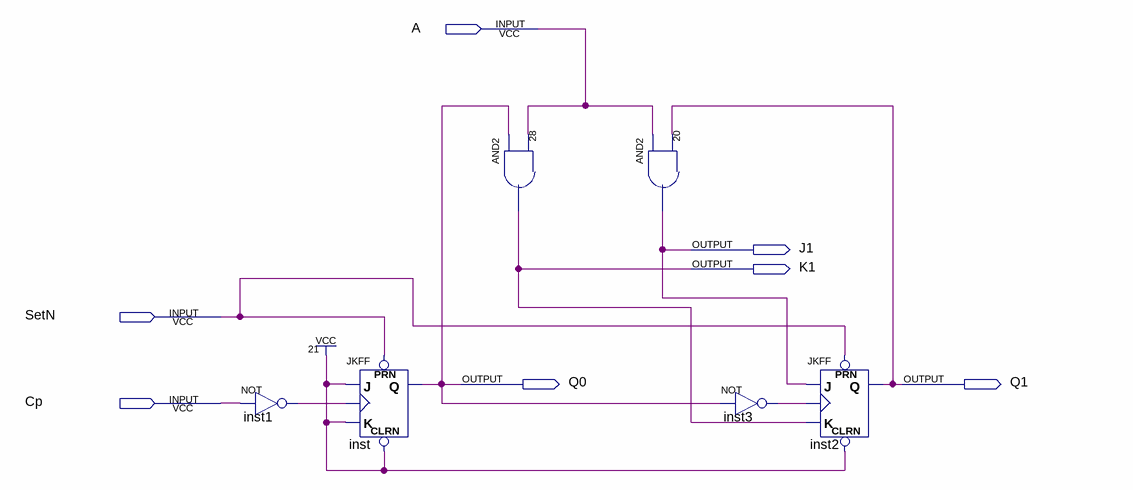
[diagram p0: schematic sheet]
// Quartus schematic Example1.bdf as structural Verilog: 6 symbols, 7 pins
module Example1 (
  input  A,
  input  SetN,
  input  Cp,
  output J1,
  output K1,
  output Q0,
  output Q1
);

  wire inst1_out, inst3_out;

  not inst1 (inst1_out, Cp);
  JKFF inst (.PRN(SetN), .CLRN(1'b1), .K(1'b1), .J(1'b1), .CLK(inst1_out), .Q(Q0));
  and u_28 (K1, Q0, A);
  and u_20 (J1, A, Q1);
  not inst3 (inst3_out, Q0);
  JKFF inst2 (.PRN(SetN), .CLRN(1'b1), .K(K1), .J(J1), .CLK(inst3_out), .Q(Q1));
endmodule
